# EAGLE design MIDI_Keyboard (EAGLE 6.6.0)
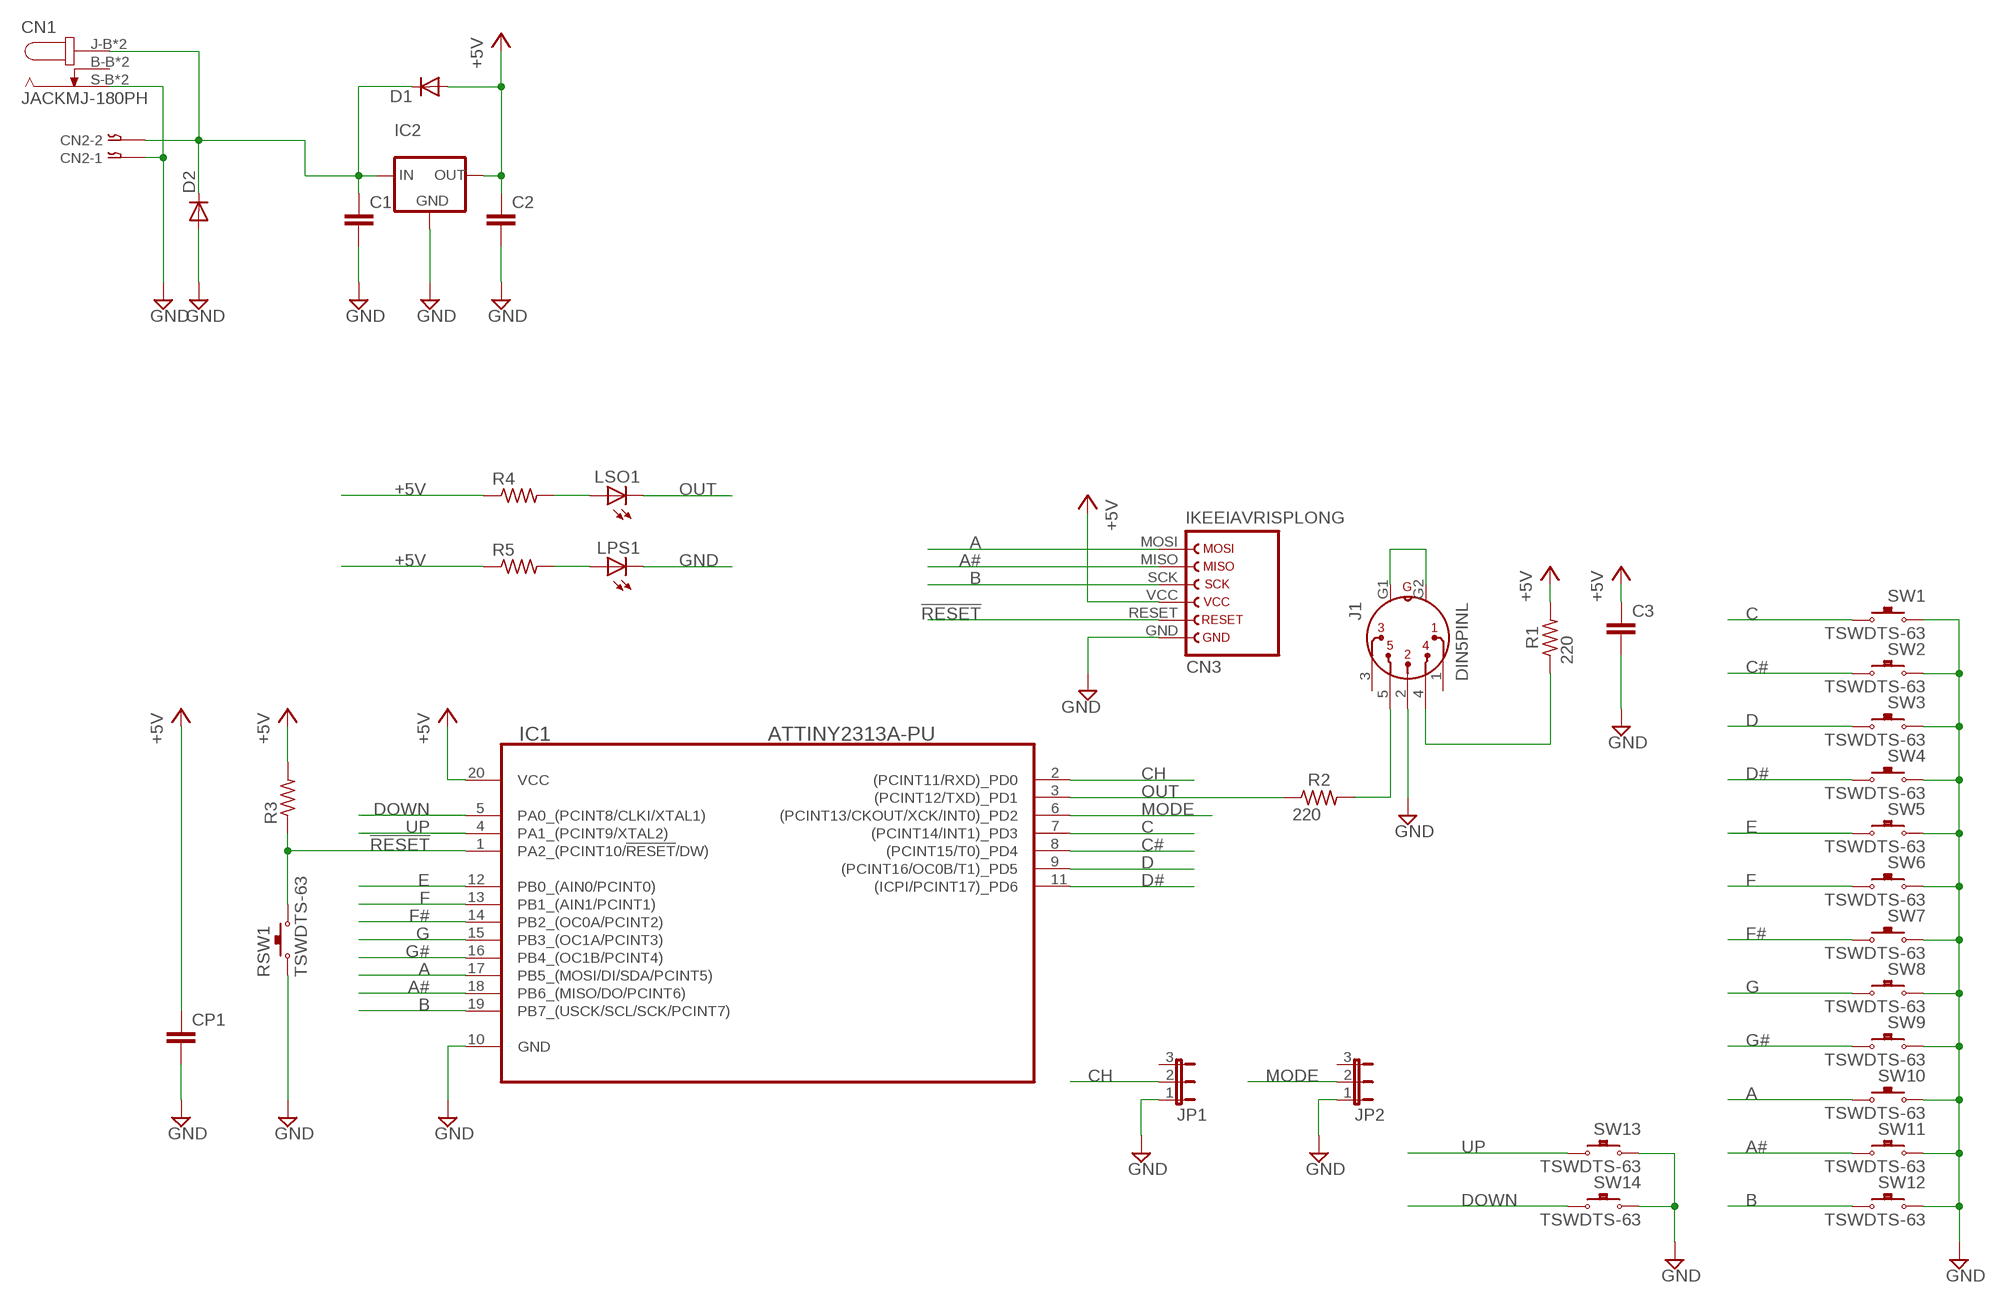
[diagram p0: schematic, sheet 1]

## Parts
C1  C-EU025-025X050  [C025-025X050]
C2  C-EU025-025X050  [C025-025X050]
C3  C-EU025-025X050  [C025-025X050]
CN1  JACKMJ-180PH  [MJ-179PH]
CN2  B2B-XH-A  [B2B-XH-A]
CN3  IKEEIAVRISPLONG  [IKEEIAVRISP]
CP1  C-EU025-025X050  [C025-025X050]
D1  1N4148DO35-10R  [DO35-10R]
D2  1N4148DO35-10R  [DO35-10R]
IC1  ATTINY2313A-PU  [DIP254P762X533-20]
IC2  78LXXL  [TO92LINE]
J1  DIN5PINL  [DIN5PINL]
JP1  JP2E  [JP2]
JP2  JP2E  [JP2]
LPS1  LED3MM  [LED3MM]
LSO1  LED3MM  [LED3MM]
R1  220  R-US_0207/10  [0207/10]
R2  220  R-US_0207/10  [0207/10]
R3  R-US_0207/10  [0207/10]
R4  R-US_0207/10  [0207/10]
R5  R-US_0207/10  [0207/10]
RSW1  TSWDTS-63  [DTS-63]
SW1  TSWDTS-63  [DTS-63]
SW2  TSWDTS-63  [DTS-63]
SW3  TSWDTS-63  [DTS-63]
SW4  TSWDTS-63  [DTS-63]
SW5  TSWDTS-63  [DTS-63]
SW6  TSWDTS-63  [DTS-63]
SW7  TSWDTS-63  [DTS-63]
SW8  TSWDTS-63  [DTS-63]
SW9  TSWDTS-63  [DTS-63]
SW10  TSWDTS-63  [DTS-63]
SW11  TSWDTS-63  [DTS-63]
SW12  TSWDTS-63  [DTS-63]
SW13  TSWDTS-63  [DTS-63]
SW14  TSWDTS-63  [DTS-63]

## Nets
!RESET: CN3.RESET IC1.1(PA2_(PCINT10/!RESET!/DW)) R3.1 RSW1.1 RSW1.2
+5V: C2.1 C3.1 CN3.VCC CP1.1 D1.A IC1.20(VCC) IC2.1(OUT) R1.2 R3.2 R4.1 R5.1
A: CN3.MOSI IC1.17(PB5_(MOSI/DI/SDA/PCINT5)) SW10.1 SW10.2
A#: CN3.MISO IC1.18(PB6_(MISO/DO/PCINT6)) SW11.1 SW11.2
B: CN3.SCK IC1.19(PB7_(USCK/SCL/SCK/PCINT7)) SW12.1 SW12.2
C: IC1.7((PCINT14/INT1)_PD3) SW1.1 SW1.2
C#: IC1.8((PCINT15/T0)_PD4) SW2.1 SW2.2
CH: IC1.2((PCINT11/RXD)_PD0) JP1.2
D: IC1.9((PCINT16/OC0B/T1)_PD5) SW3.1 SW3.2
D#: IC1.11((ICPI/PCINT17)_PD6) SW4.1 SW4.2
DOWN: IC1.5(PA0_(PCINT8/CLKI/XTAL1)) SW14.1 SW14.2
E: IC1.12(PB0_(AIN0/PCINT0)) SW5.1 SW5.2
F: IC1.13(PB1_(AIN1/PCINT1)) SW6.1 SW6.2
F#: IC1.14(PB2_(OC0A/PCINT2)) SW7.1 SW7.2
G: IC1.15(PB3_(OC1A/PCINT3)) SW8.1 SW8.2
G#: IC1.16(PB4_(OC1B/PCINT4)) SW9.1 SW9.2
GND: C1.2 C2.2 C3.2 CN1.S-B CN1.S-T CN2.1 CN3.GND CP1.2 D2.A IC1.10(GND) IC2.2(GND) J1.2 JP1.1 JP2.1 LPS1.K(C) RSW1.3 RSW1.4 SW1.3 SW1.4 SW2.3 SW2.4 SW3.3 SW3.4 SW4.3 SW4.4 SW5.3 SW5.4 SW6.3 SW6.4 SW7.3 SW7.4 SW8.3 SW8.4 SW9.3 SW9.4 SW10.3 SW10.4 SW11.3 SW11.4 SW12.3 SW12.4 SW13.3 SW13.4 SW14.3 SW14.4
MODE: IC1.6((PCINT13/CKOUT/XCK/INT0)_PD2) JP2.2
N$1: J1.4 R1.1
N$2: J1.5 R2.2
N$3: J1.G1 J1.G2
N$6: LSO1.A R4.2
N$7: LPS1.A R5.2
N$16: C1.1 CN1.J-B CN1.J-T CN2.2 D1.C D2.C IC2.3(IN)
OUT: IC1.3((PCINT12/TXD)_PD1) LSO1.K(C) R2.1
UP: IC1.4(PA1_(PCINT9/XTAL2)) SW13.1 SW13.2
Unconnected: CN1.B-B CN1.B-T J1.1 J1.3 JP1.3 JP2.3

## Library data of the parts
C1-C3 CP1 = rcl:C-EU: CAPACITOR, European symbol
CN1 = domino:JACK
CN2 = con-jst:B2B-XH-A
CN3 = domino:IKEEIAVRISP
D1 D2 = diode:1N4148: DIODE high speed (Philips)
IC1 = Atmel_By_element14_Batch_1-00:ATTINY2313A-PU: 8-bit Microcontroller; DESCRIPTION: 8-bit Microcontroller; MPN: ATTINY2313A-PU; OC_FARNELL: 1841616; OC_NEWARK: 12T1333; PACKAGE: DIP-20; SUPPLIER: Atmel
IC2 = v-reg:78LXXL
J1 = domino:DIN5PINL
JP1 JP2 = jumper:JP2E: JUMPER
LPS1 LSO1 = led:LED: LED OSRAM: - CHIPLED LG R971, LG N971, LY N971, LG Q971, LY Q971, LO R971, LY R971 LH N974, LH R974 LS Q976, LO Q976, LY Q976 LO Q996 - Hyper CHIPLED LW Q18S LB Q993, LB Q99A, LB R99A - SideLED LS A670, LO A670, LY A670, LG A670, LP A670 LB A673, LV A673, LT A673, LW A673 LH A674 LY A675 LS A676, LA A676, LO A676, LY A676, LW A676 LS A679, LY A679, LG A679 - Hyper Micro SIDELED® LS Y876, LA Y876, LO Y876, LY Y876 LT Y87S - SmartLED LW L88C, LW L88S LB L89C, LB L89S, LG L890 LS L89K, LO L89K, LY L89K LS L896, LA L896, LO L896, LY L896 - TOPLED LS T670, LO T670, LY T670, LG T670, LP T670 LSG T670, LSP T670, LSY T670, LOP T670, LYG T670 LG T671, LOG T671, LSG T671 LB T673, LV T673, LT T673, LW T673 LH T674 LS T676, LA T676, LO T676, LY T676, LB T676, LH T676, LSB T676, LW T676 LB T67C, LV T67C, LT T67C, LS T67K, LO T67K, LY T67K, LW E67C LS E67B, LA E67B, LO E67B, LY E67B, LB E67C, LV E67C, LT E67C LW T67C LS T679, LY T679, LG T679 LS T770, LO T770, LY T770, LG T770, LP T770 LB T773, LV T773, LT T773, LW T773 LH T774 LS E675, LA E675, LY E675, LS T675 LS T776, LA T776, LO T776, LY T776, LB T776 LHGB T686 LT T68C, LB T68C - Hyper Mini TOPLED® LB M676 - Mini TOPLED Santana® LG M470 LS M47K, LO M47K, LY M47K Source: http://www.osram.convergy.de LUXEON: - LUMILED® LXK2-PW12-R00, LXK2-PW12-S00, LXK2-PW14-U00, LXK2-PW14-V00 LXK2-PM12-R00, LXK2-PM12-S00, LXK2-PM14-U00 LXK2-PE12-Q00, LXK2-PE12-R00, LXK2-PE12-S00, LXK2-PE14-T00, LXK2-PE14-U00 LXK2-PB12-K00, LXK2-PB12-L00, LXK2-PB12-M00, LXK2-PB14-N00, LXK2-PB14-P00, LXK2-PB14-Q00 LXK2-PR12-L00, LXK2-PR12-M00, LXK2-PR14-Q00, LXK2-PR14-R00 LXK2-PD12-Q00, LXK2-PD12-R00, LXK2-PD12-S00 LXK2-PH12-R00, LXK2-PH12-S00 LXK2-PL12-P00, LXK2-PL12-Q00, LXK2-PL12-R00 Source: www.luxeon.com KINGBRIGHT: KA-3528ASYC Source: www.kingbright.com
R1-R5 = rcl:R-US_: RESISTOR, American symbol
RSW1 SW1-SW14 = domino:TSW

## Board
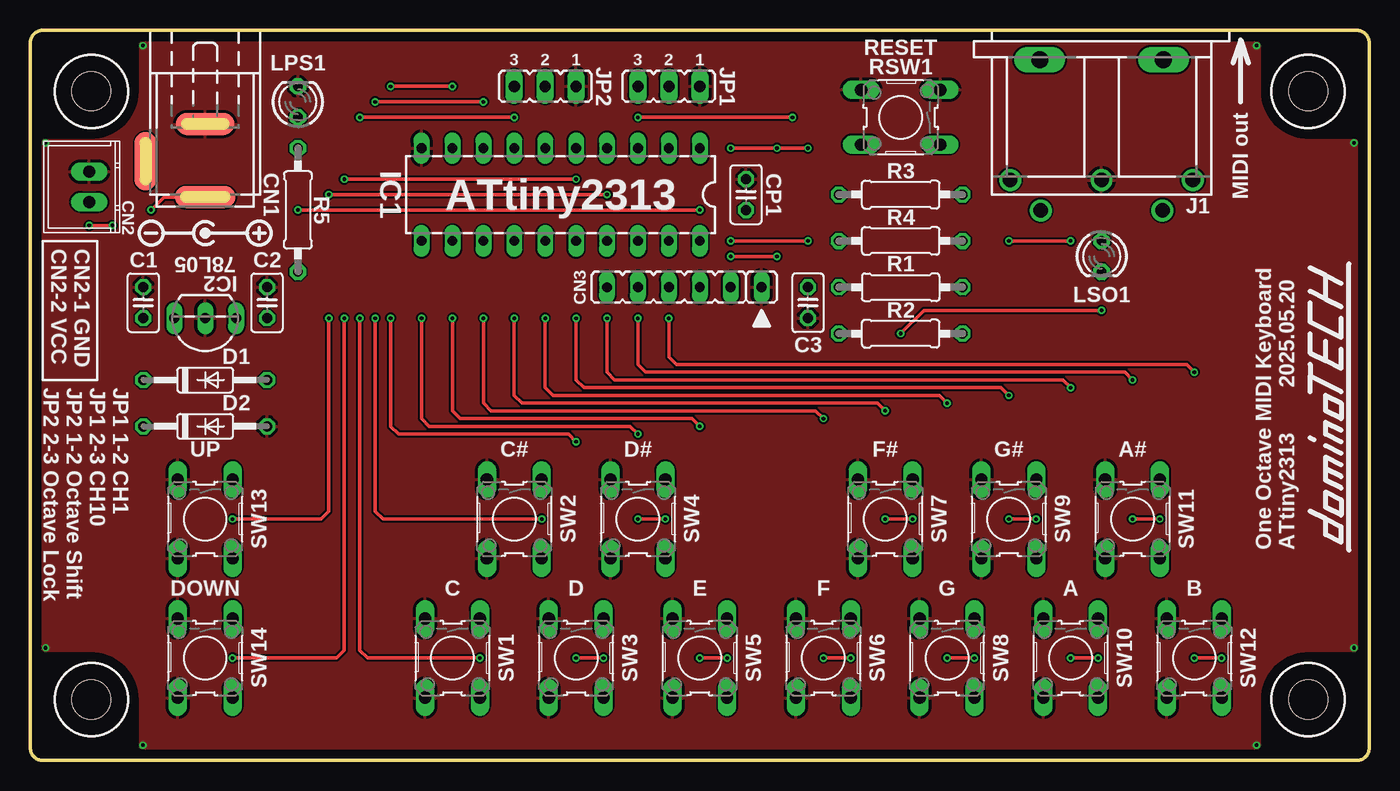
[diagram p1: board, top side]
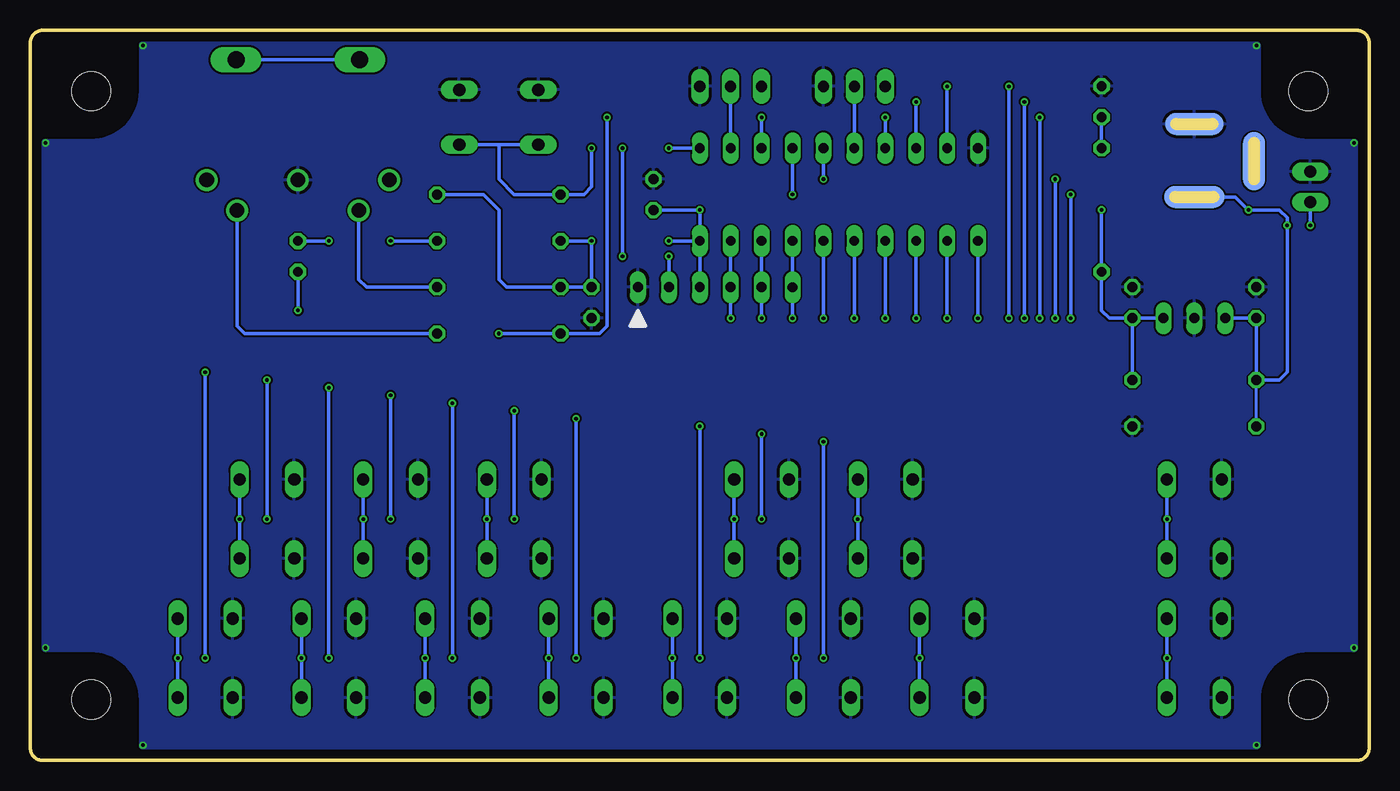
[diagram p2: board, bottom side, seen from below]

Size 110 x 60 mm. Coordinates in mm from the lower left corner, seen from the top.
Outline: 109,0 1,0 arc-90 0,1 0,59 arc-90 1,60 109,60 arc-90 110,59 110,1 arc-90 109,0
Copper layers (1*16): Top 0.035mm / dielectric 1.5mm / Bottom 0.035mm
Design rules "SeeedStudio_2layer_DRU_no_angle_20140221": minimum track width 6mil, minimum drill 0.2mm, track to track 6mil, track to pad 6mil, pad to pad 6mil, via to via 6mil, smd to smd 0mil, copper to edge 0.3mm, drill to drill 0.3mm, minimum pad ring 10mil, minimum via ring 0.15mm, stop-mask expansion 2mil, vias tented up to drill 100mil, thermal gap 10mil
Holes 3.2 mm at 105,5 5,5 5,55 105,55
vRestrict: area 96.5,60 to 102.5,66; area 96.5,-6 to 102.5,0; area 7.5,60 to 13.5,66; area 7.5,-6 to 13.5,0

### Footprints (pad centres in the part's own frame; a part is rotated, then mirrored left to right if it is on the bottom)
C025-025X050 = drill 0.813 octagon: 1 -1.27,0; 2 1.27,0
MJ-179PH = smd 4.8 x 1.8 bottom: B-B 10.75,-4.9 | smd 4.8 x 1.8: B-T 10.75,-4.9 | smd 1.8 x 5 bottom: J-B 13.7,0 | smd 1.8 x 5: J-T 13.7,0 | smd 1.8 x 4.8 bottom: S-B 7.7,0 | smd 1.8 x 4.8: S-T 7.7,0
B2B-XH-A = drill 1 long: 1 -1.25,0; 2 1.25,0
IKEEIAVRISP = drill 0.813 long: GND -6.35,0; MISO 3.81,0; RESET -3.81,0; SCK 1.27,0; VCC -1.27,0 | drill 0.8 long: MOSI 6.35,0
DO35-10R = drill 0.813 octagon: A 5.08,0; C -5.08,0
DIP254P762X533-20 = drill 0.8 long: 1 -3.81,11.43; 2 -3.81,8.89; 3 -3.81,6.35; 4 -3.81,3.81; 5 -3.81,1.27; 6 -3.81,-1.27; 7 -3.81,-3.81; 8 -3.81,-6.35; 9 -3.81,-8.89; 10 -3.81,-11.43; 11 3.81,-11.43; 12 3.81,-8.89; 13 3.81,-6.35; 14 3.81,-3.81; 15 3.81,-1.27; 16 3.81,1.27; 17 3.81,3.81; 18 3.81,6.35; 19 3.81,8.89; 20 3.81,11.43
TO92LINE = drill 0.813 long: 1 -2.54,0; 2 0,0; 3 2.54,0
DIN5PINL = drill 1.2: 1 -7.5,-12.3; 2 0,-12.3; 3 7.5,-12.3; 4 -5,-14.8; 5 5,-14.8 | drill 1.4 long: G1 -5.08,-2.4; G2 5.08,-2.4
JP2 = drill 0.914 long: 1 -2.54,0; 2 0,0; 3 2.54,0
LED3MM = drill 0.813 octagon: A -1.27,0; K 1.27,0
0207/10 = drill 0.813 octagon: 1 -5.08,0; 2 5.08,0
DTS-63 = drill 1 long: 1 -3.25,2.25; 2 3.25,2.25; 3 -3.25,-2.25; 4 3.25,-2.25

### Placement (x,y rotation side)
C1  9.28,37.62 90 top
C2  19.44,37.62 90 top
C3  63.89,37.62 270 top
CN1  14.36,60 270 top
CN2  4.84,47.14 270 top
CN3  53.73,38.89 180 top
CP1  58.81,46.51 90 top
D1  14.36,31.27 0 top
D2  14.36,27.46 0 top
IC1  43.57,46.51 270 top
IC2  14.36,36.35 180 top
J1  88.02,60 0 top
JP1  52.46,55.4 180 top
JP2  42.3,55.4 180 top
LPS1  21.98,54.13 90 top
LSO1  88.02,41.43 270 top
R1  71.51,38.89 180 top
R2  71.51,35.08 0 top
R3  71.51,46.51 0 top
R4  71.51,42.7 0 top
R5  21.98,45.24 90 top
RSW1  71.51,52.86 180 top
SW1  34.68,8.41 270 top
SW2  39.76,19.84 270 top
SW3  44.84,8.41 270 top
SW4  49.92,19.84 270 top
SW5  55,8.41 270 top
SW6  65.16,8.41 270 top
SW7  70.24,19.84 270 top
SW8  75.32,8.41 270 top
SW9  80.4,19.84 270 top
SW10  85.48,8.41 270 top
SW11  90.56,19.84 270 top
SW12  95.64,8.41 270 top
SW13  14.36,19.84 270 top
SW14  14.36,8.41 270 top

### Tracks (layer width: path | path; a pad name or v marks a point on that pad's centre or on a via)
!RESET  (via drill 0.3)
  Top 0.3: v57.54,50.32 v61.35,50.32 v63.89,50.32 | v57.54,41.43 v61.35,41.43
  Bottom 0.3: RSW1.1 71.51,50.61 | 71.51,50.61 RSW1.2 | CN3.RESET v57.54,41.43 | v57.54,50.32 IC1.1 | v63.89,50.32 63.89,47.14 64.53,46.51 R3.1 70.24,46.51 71.51,47.78 71.51,50.61 | v61.35,41.43 v61.35,50.32
+5V  (via drill 0.3)
  Top 0.3: v63.89,42.7 v57.54,42.7 | v55,45.24 v21.98,45.24
  Bottom 0.3: CP1.1 v55,45.24 IC1.20 | IC1.20 CN3.VCC | R3.2 72.78,46.51 71.51,45.24 71.51,39.52 70.88,38.89 R1.2 C3.1 v63.89,42.7 R4.1 | IC2.1 C2.1 | C2.1 D1.A | v57.54,42.7 IC1.20 | C2.1 21.34,36.35 21.98,36.98 R5.1 v21.98,45.24
A  (via drill 0.3)
  Top 0.3: v87.73,8.41 v85.48,8.41 | v85.48,30.64 84.84,31.27 48.02,31.27 47.38,31.91 v47.38,36.35
  Bottom 0.3: SW10.2 v87.73,8.41 SW10.1 | v85.48,8.41 v85.48,30.64 | IC1.17 CN3.MOSI v47.38,36.35
A#  (via drill 0.3)
  Top 0.3: v92.81,19.84 v90.56,19.84 | v90.56,31.27 89.92,31.91 50.55,31.91 49.92,32.54 v49.92,36.35
  Bottom 0.3: SW11.2 v92.81,19.84 SW11.1 | v90.56,19.84 v90.56,31.27 | IC1.18 CN3.MISO v49.92,36.35
B  (via drill 0.3)
  Top 0.3: v95.64,31.91 95,32.54 53.09,32.54 52.46,33.17 v52.46,36.35 | v97.89,8.41 v95.64,8.41
  Bottom 0.3: v95.64,31.91 v95.64,8.41 | SW12.2 v97.89,8.41 SW12.1 | IC1.19 CN3.SCK v52.46,36.35
C  (via drill 0.3)
  Top 0.3: v36.93,8.41 27.7,8.41 27.06,9.05 v27.06,36.35 | v27.06,52.86 v39.76,52.86
  Bottom 0.3: SW1.2 v36.93,8.41 SW1.1 | v27.06,36.35 v27.06,52.86 | IC1.7 v39.76,52.86
C#  (via drill 0.3)
  Top 0.3: v28.33,54.13 v37.22,54.13 | v42.01,19.84 28.96,19.84 28.33,20.48 v28.33,36.35
  Bottom 0.3: SW2.2 v42.01,19.84 SW2.1 | v28.33,36.35 v28.33,54.13 | IC1.8 v37.22,54.13
CH
  Bottom 0.3: IC1.2 JP1.2
D  (via drill 0.3)
  Top 0.3: v34.68,55.4 v29.6,55.4 | v47.09,8.41 v44.84,8.41 | v44.84,26.19 44.2,26.82 30.23,26.82 29.6,27.46 v29.6,36.35
  Bottom 0.3: SW3.2 v47.09,8.41 SW3.1 | v44.84,8.41 v44.84,26.19 | v29.6,36.35 v29.6,55.4 | IC1.9 v34.68,55.4
D#  (via drill 0.3)
  Top 0.3: v52.17,19.84 v49.92,19.84 | v49.92,26.82 49.28,27.46 32.77,27.46 32.14,28.09 v32.14,36.35
  Bottom 0.3: SW4.2 v52.17,19.84 SW4.1 | v49.92,19.84 v49.92,26.82 | v32.14,36.35 IC1.11
DOWN  (via drill 0.3)
  Top 0.3: v44.84,47.78 v25.79,47.78 | v25.79,36.35 25.79,9.05 25.16,8.41 v16.61,8.41
  Bottom 0.3: IC1.5 v44.84,47.78 | v25.79,47.78 v25.79,36.35 | SW14.1 v16.61,8.41 SW14.2
E  (via drill 0.3)
  Top 0.3: v57.25,8.41 v55,8.41 | v55,27.46 54.37,28.09 35.31,28.09 34.68,28.73 v34.68,36.35
  Bottom 0.3: SW5.2 v57.25,8.41 SW5.1 | v55,8.41 v55,27.46 | v34.68,36.35 IC1.12
F  (via drill 0.3)
  Top 0.3: v67.41,8.41 v65.16,8.41 | v65.16,28.09 64.53,28.73 37.86,28.73 37.22,29.36 v37.22,36.35
  Bottom 0.3: SW6.2 v67.41,8.41 SW6.1 | v65.16,8.41 v65.16,28.09 | v37.22,36.35 IC1.13
F#  (via drill 0.3)
  Top 0.3: v72.49,19.84 v70.24,19.84 | v70.24,28.73 69.61,29.36 40.39,29.36 39.76,30 v39.76,36.35
  Bottom 0.3: SW7.2 v72.49,19.84 SW7.1 | v70.24,19.84 v70.24,28.73 | v39.76,36.35 IC1.14
G  (via drill 0.3)
  Top 0.3: v42.3,36.35 42.3,30.64 42.94,30 74.69,30 v75.32,29.36 | v77.57,8.41 v75.32,8.41
  Bottom 0.3: v75.32,29.36 v75.32,8.41 | SW8.2 v77.57,8.41 SW8.1 | v42.3,36.35 IC1.15
G#  (via drill 0.3)
  Top 0.3: v82.65,19.84 v80.4,19.84 | v80.4,30 79.77,30.64 45.48,30.64 44.84,31.27 v44.84,36.35
  Bottom 0.3: SW9.2 v82.65,19.84 SW9.1 | v80.4,19.84 v80.4,30 | v44.84,36.35 IC1.16
GND  (via drill 0.3)
  other vias: 1.25,9.25 1.25,50.75 9.25,58.75 100.75,58.75 108.75,50.75 108.75,9.25 100.75,1.25 9.25,1.25
  pour Bottom: 101,55 101,58.75 arc90 100.75,59 9.25,59 arc90 9,58.75 9,55 arc-90 5,51 1.25,51 arc90 1,50.75 1,9.25 arc90 1.25,9 5,9 arc-90 9,5 9,1.25 arc90 9.25,1 100.75,1 arc90 101,1.25 101,5 arc-90 105,9 108.75,9 arc90 109,9.25 109,50.75 arc90 108.75,51 105,51 arc-90
  pour Top: 9.25,59 100.75,59 arc-90 101,58.75 101,55 arc90 105,51 108.75,51 arc-90 109,50.75 109,9.25 arc-90 108.75,9 105,9 arc90 101,5 101,1.25 arc-90 100.75,1 9.25,1 arc-90 9,1.25 9,5 arc90 5,9 1.25,9 arc-90 1,9.25 1,50.75 arc-90 1.25,51 5,51 arc90 9,55 9,58.75 arc-90
MODE
  Bottom 0.3: IC1.6 JP2.2
N$1
  Bottom 0.3: J1.4 83.02,39.52 82.39,38.89 R1.1
N$2
  Bottom 0.3: J1.5 93.02,35.72 92.38,35.08 R2.2
N$3
  Bottom 0.3: J1.G1 J1.G2
N$6  (via drill 0.3)
  Top 0.3: v85.48,42.7 v80.4,42.7
  Bottom 0.3: LSO1.A v85.48,42.7 | v80.4,42.7 R4.2
N$7
  Bottom 0.3: LPS1.A R5.2
N$16  (via drill 0.3)
  Top 0.3: CN1.J-T 10.98,46.3 v9.91,45.24 | v4.84,43.97 v6.74,43.97
  Bottom 0.24: D2.C D1.C
  Bottom 0.3: IC2.3 C1.1 D1.C 7.38,31.27 6.74,31.91 v6.74,43.97 6.74,44.61 7.38,45.24 v9.91,45.24 10.98,46.3 CN1.J-T | CN2.2 v4.84,43.97
OUT  (via drill 0.3)
  Top 0.3: v62.62,52.86 v49.92,52.86 | v88.02,36.98 73.41,36.98 v71.51,35.08
  Bottom 0.3: v49.92,52.86 IC1.3 | v62.62,52.86 62.62,35.72 63.26,35.08 R2.1 v71.51,35.08 | LSO1.K v88.02,36.98
UP  (via drill 0.3)
  Top 0.3: v16.61,19.84 23.89,19.84 24.52,20.48 v24.52,36.35 | v24.52,46.51 v47.38,46.51
  Bottom 0.3: SW13.2 v16.61,19.84 SW13.1 | v24.52,36.35 v24.52,46.51 | v47.38,46.51 IC1.4

### Text on the board
tPlace: RESET | MIDI out | ATtiny2313 | CN2-2 VCC | CN2-1 GND | 78L05 | JP2 2-3 Octave Lock | JP2 1-2 Octave Shift | JP1 2-3 CH10 | JP1 1-2 CH1 | 2025.05.20 | UP | C# | D# | F# | G# | A# | One Octave MIDI Keyboard | ATtiny2313 | DOWN | C | D | E | F | G | A | B